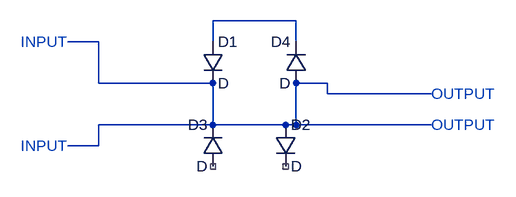
[diagram p0: schematic Puente diodos.asc]
Puente diodos.asc, the LTspice schematic file:
Version 4
SHEET 1 880 680
WIRE 336 64 208 64
WIRE 32 96 -16 96
WIRE 208 96 208 64
WIRE 336 96 336 64
WIRE 32 160 32 96
WIRE 208 160 32 160
WIRE 384 160 336 160
WIRE 384 176 384 160
WIRE 544 176 384 176
WIRE 208 224 208 160
WIRE 208 224 32 224
WIRE 320 224 208 224
WIRE 336 224 336 160
WIRE 336 224 320 224
WIRE 544 224 336 224
WIRE 32 256 32 224
WIRE 32 256 -16 256
SYMBOL diode 192 96 R0
SYMATTR InstName D1
SYMBOL diode 304 224 R0
SYMATTR InstName D2
SYMBOL diode 224 288 R180
WINDOW 0 24 64 Left 2
WINDOW 3 24 0 Left 2
SYMATTR InstName D3
SYMBOL diode 352 160 R180
WINDOW 0 24 64 Left 2
WINDOW 3 24 0 Left 2
SYMATTR InstName D4
TEXT -88 96 Left 2 ;INPUT
TEXT -88 256 Left 2 ;INPUT
TEXT 544 176 Left 2 ;OUTPUT
TEXT 544 224 Left 2 ;OUTPUT

The netlist it stands for:
* Puente diodos.asc
D1 N001 N002 D
D2 N002 NC_01 D
D3 NC_02 N002 D
D4 N002 N001 D
.model D D
.lib standard.dio
* INPUT
* INPUT
* OUTPUT
* OUTPUT
.backanno
.end